# Altium project NB3000AL.PRJPCB (part 3 of 3)

## Sheet Mounts.SchDoc: NB3000AL Holes and Graphics
size A4; Organization: Altium Limited.; DocumentNumber: 19; Revision: 6; SheetNumber: 20; SheetTotal: 78
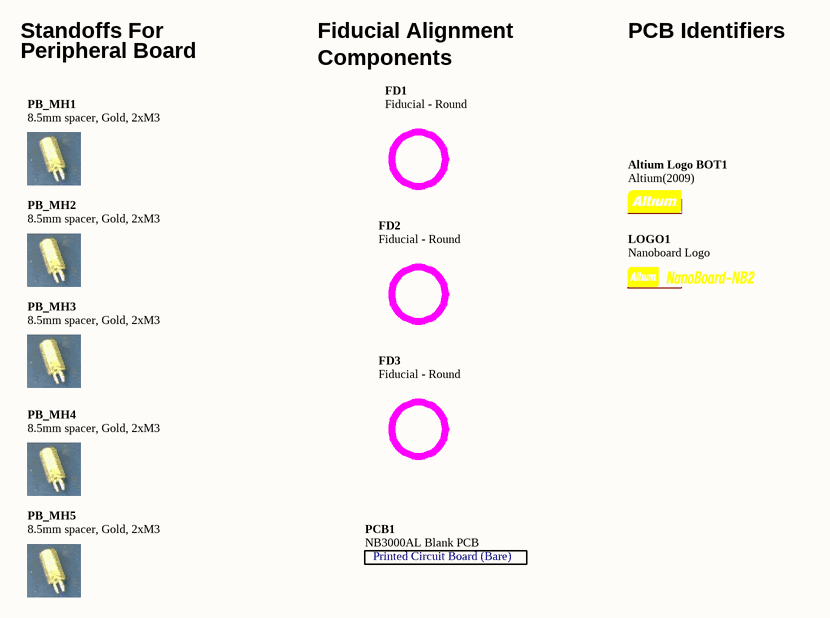
[diagram p24: Mounts.SchDoc]

### Parts
Altium_Logo_BOT1  Altium(2009)  [Logo-Altium-New]  (no BOM)
FD1  Fiducial - Round  [FIDUCIAL ROUND]  (no BOM)
FD2  Fiducial - Round  [FIDUCIAL ROUND]  (no BOM)
FD3  Fiducial - Round  [FIDUCIAL ROUND]  (no BOM)
LOGO1  Nanoboard Logo  [NANOBOARD LOGO]  (no BOM)
PB_MH1  8.5mm spacer, Gold, 2xM3  [STANDOFF_SOLDER_3MM]
PB_MH2  8.5mm spacer, Gold, 2xM3  [STANDOFF_SOLDER_3MM]
PB_MH3  8.5mm spacer, Gold, 2xM3  [STANDOFF_SOLDER_3MM]
PB_MH4  8.5mm spacer, Gold, 2xM3  [STANDOFF_SOLDER_3MM]
PB_MH5  8.5mm spacer, Gold, 2xM3  [STANDOFF_SOLDER_3MM]
PCB1  NB3000AL Blank PCB

### Nets
SHIELD: PB_MH1.STAND PB_MH2.STAND PB_MH3.STAND PB_MH4.STAND PB_MH5.STAND

### Notes on the sheet
- Peripheral Board
- Standoffs For
- Fiducial Alignment
- Components
- PCB Identifiers
- Sheet Title
- Project Title
- Size:
- Date:
- A4
- Assy:
- Time:
- Revision:
- Sheet
- of
- File:
- (in symbol D-810-0053) Printed Circuit Board (Bare)

### Library data of the parts
Altium_Logo_BOT1 = D-000-0003: Altium Logo for PCB; Category: Graphic-PCB; Status: Production
FD1-FD3 = D-004-0001: Fiducial - Round 1.5mm Top-Bottom; Status: Unreleased; Category: Fiducial
LOGO1 = D-000-0000: Status: Production; Category: Graphic-PCB
PB_MH1-PB_MH5 = D-306-0001: Spacer, 8.5mm GOLD, Splitted bottom, Female M3-thread; Category: Standoff; Status: Production
PCB1 = D-810-0053: NB3000AL Blank PCB - NanoBoard  3000 Series with Altera Cyclone3; ProjectPath: NB3000AL.PrjPCB; Status: Unreleased; Category: Blank PCB

## Sheet PBCON.schdoc: Peripheral Board Connector
size A4; Organization: Altium Limited.; Address1: Level 3, 12a Rodborough Rd; Address2: Frenchs Forest 2086; Address3: NSW; Address4: AUSTRALIA; SheetNumber: 1; SheetTotal: 100
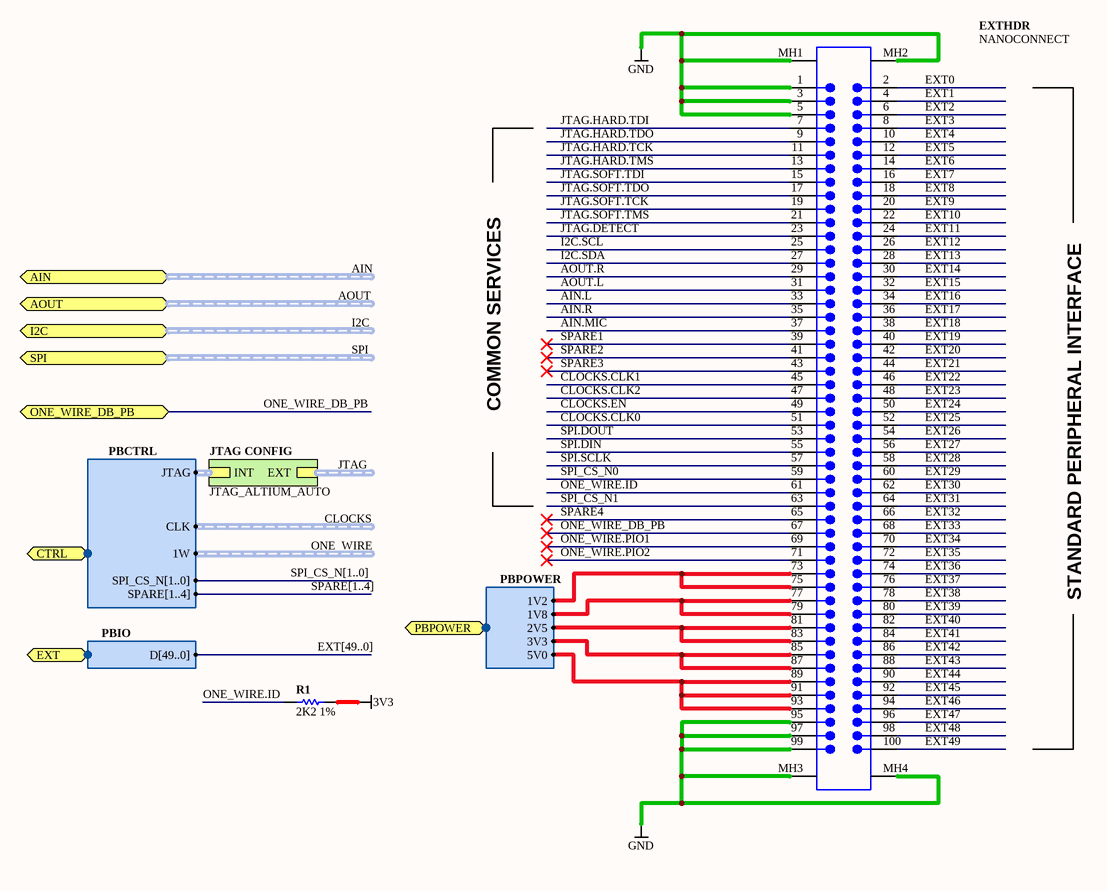
[diagram p25: PBCON.schdoc]

### Parts
(Parts that share a designator on the sheet are numbered #1, #2 ... from top to bottom, then left to right.)
EXTHDR  NANOCONNECT  [53751]
R1#5  2K2 1%  [RESC1005-STAR]

### Sub-sheets
JTAG CONFIG = JTAG_ALTIUM_AUTO (file not in this document): EXT (harness JTAG_CONFIG), INT (harness JTAG_CONFIG)

### Ports
AIN (harness AUDIO_IN), AOUT (harness AUDIO_OUT), CTRL (harness PBCTRL), EXT (harness PBIO), I2C (harness I2C), ONE_WIRE_DB_PB (bidir), PBPOWER (harness PBPOWER), SPI (harness EXTSPI)

### Harnesses
PBIO: D[49..0]
PBCTRL: JTAG, CLK, 1W, SPI_CS_N[1..0], SPARE[1..4]
PBPOWER: 1V2, 1V8, 2V5, 3V3, 5V0

### Nets
3V3: R1#5.2
GND: EXTHDR.1 EXTHDR.3 EXTHDR.5 EXTHDR.95 EXTHDR.97 EXTHDR.99 EXTHDR.MH1 EXTHDR.MH2 EXTHDR.MH3 EXTHDR.MH4
AIN.L: EXTHDR.33
AIN.MIC: EXTHDR.37
AIN.R: EXTHDR.35
AOUT.L: EXTHDR.31
AOUT.R: EXTHDR.29
CLOCKS.CLK0: EXTHDR.51
CLOCKS.CLK1: EXTHDR.45
CLOCKS.CLK2: EXTHDR.47
CLOCKS.EN: EXTHDR.49
EXT0: EXTHDR.2
EXT1: EXTHDR.4
EXT2: EXTHDR.6
EXT3: EXTHDR.8
EXT4: EXTHDR.10
EXT5: EXTHDR.12
EXT6: EXTHDR.14
EXT7: EXTHDR.16
EXT8: EXTHDR.18
EXT9: EXTHDR.20
EXT10: EXTHDR.22
EXT11: EXTHDR.24
EXT12: EXTHDR.26
EXT13: EXTHDR.28
EXT14: EXTHDR.30
EXT15: EXTHDR.32
EXT16: EXTHDR.34
EXT17: EXTHDR.36
EXT18: EXTHDR.38
EXT19: EXTHDR.40
EXT20: EXTHDR.42
EXT21: EXTHDR.44
EXT22: EXTHDR.46
EXT23: EXTHDR.48
EXT24: EXTHDR.50
EXT25: EXTHDR.52
EXT26: EXTHDR.54
EXT27: EXTHDR.56
EXT28: EXTHDR.58
EXT29: EXTHDR.60
EXT30: EXTHDR.62
EXT31: EXTHDR.64
EXT32: EXTHDR.66
EXT33: EXTHDR.68
EXT34: EXTHDR.70
EXT35: EXTHDR.72
EXT36: EXTHDR.74
EXT37: EXTHDR.76
EXT38: EXTHDR.78
EXT39: EXTHDR.80
EXT40: EXTHDR.82
EXT41: EXTHDR.84
EXT42: EXTHDR.86
EXT43: EXTHDR.88
EXT44: EXTHDR.90
EXT45: EXTHDR.92
EXT46: EXTHDR.94
EXT47: EXTHDR.96
EXT48: EXTHDR.98
EXT49: EXTHDR.100
I2C.SCL: EXTHDR.25
I2C.SDA: EXTHDR.27
JTAG.DETECT: EXTHDR.23
JTAG.HARD.TCK: EXTHDR.11
JTAG.HARD.TDI: EXTHDR.7
JTAG.HARD.TDO: EXTHDR.9
JTAG.HARD.TMS: EXTHDR.13
JTAG.SOFT.TCK: EXTHDR.19
JTAG.SOFT.TDI: EXTHDR.15
JTAG.SOFT.TDO: EXTHDR.17
JTAG.SOFT.TMS: EXTHDR.21
ONE_WIRE.ID: EXTHDR.61 R1#5.1
ONE_WIRE.PIO1: EXTHDR.69
ONE_WIRE.PIO2: EXTHDR.71
ONE_WIRE_DB_PB: EXTHDR.67 ; port ONE_WIRE_DB_PB
SPARE1: EXTHDR.39
SPARE2: EXTHDR.41
SPARE3: EXTHDR.43
SPARE4: EXTHDR.65
SPI.DIN: EXTHDR.55
SPI.DOUT: EXTHDR.53
SPI.SCLK: EXTHDR.57
SPI_CS_N0: EXTHDR.59
SPI_CS_N1: EXTHDR.63
NetEXTHDR_73: EXTHDR.73 EXTHDR.75 ; port PBPOWER.1V2
NetEXTHDR_77: EXTHDR.77 EXTHDR.79 ; port PBPOWER.1V8
NetEXTHDR_81: EXTHDR.81 EXTHDR.83 ; port PBPOWER.2V5
NetEXTHDR_85: EXTHDR.85 EXTHDR.87 ; port PBPOWER.3V3
NetEXTHDR_89: EXTHDR.89 EXTHDR.91 EXTHDR.93 ; port PBPOWER.5V0

### Buses and harness runs
bus EXT[49..0]
bus SPARE[1..4]
bus SPI_CS_N[1..0]
harness AIN = port AIN
harness AOUT = port AOUT
harness I2C = port I2C
harness JTAG = sheet JTAG CONFIG/EXT
harness SPI = port SPI

### Notes on the sheet
- COMMON SERVICES
- STANDARD PERIPHERAL INTERFACE
- Sheet Title
- Project Title
- Size:
- Date:
- A4
- Assy:
- Time:
- Revision:
- Sheet
- of
- File:

### Library data of the parts
EXTHDR = D-300-0026: Connector, Molex Docking Station 100 Pin Female 53751; Connector type: MOLEX - 53751-1009; Category: Connector; Status: Production
R1#5 = D-100-0107: Resistor, 2K2 1% 0402 (1005); Power Rating: 63 mW; Resistance: 2.2 K; Category: Resistor; Mounting Technology: Surface Mount; Status: Production; Tolerance: 1 %

## Sheet CON_SPDIF_INOUT_A.SchDoc: S/PDIF RCA IN/OUT
size A4; Organization: Altium Limited.; Address1: Level 3, 12a Rodborough Rd; Address2: Frenchs Forest 2086; Address3: NSW; Address4: AUSTRALIA; DocumentNumber: 51; SheetNumber: 52; SheetTotal: 78
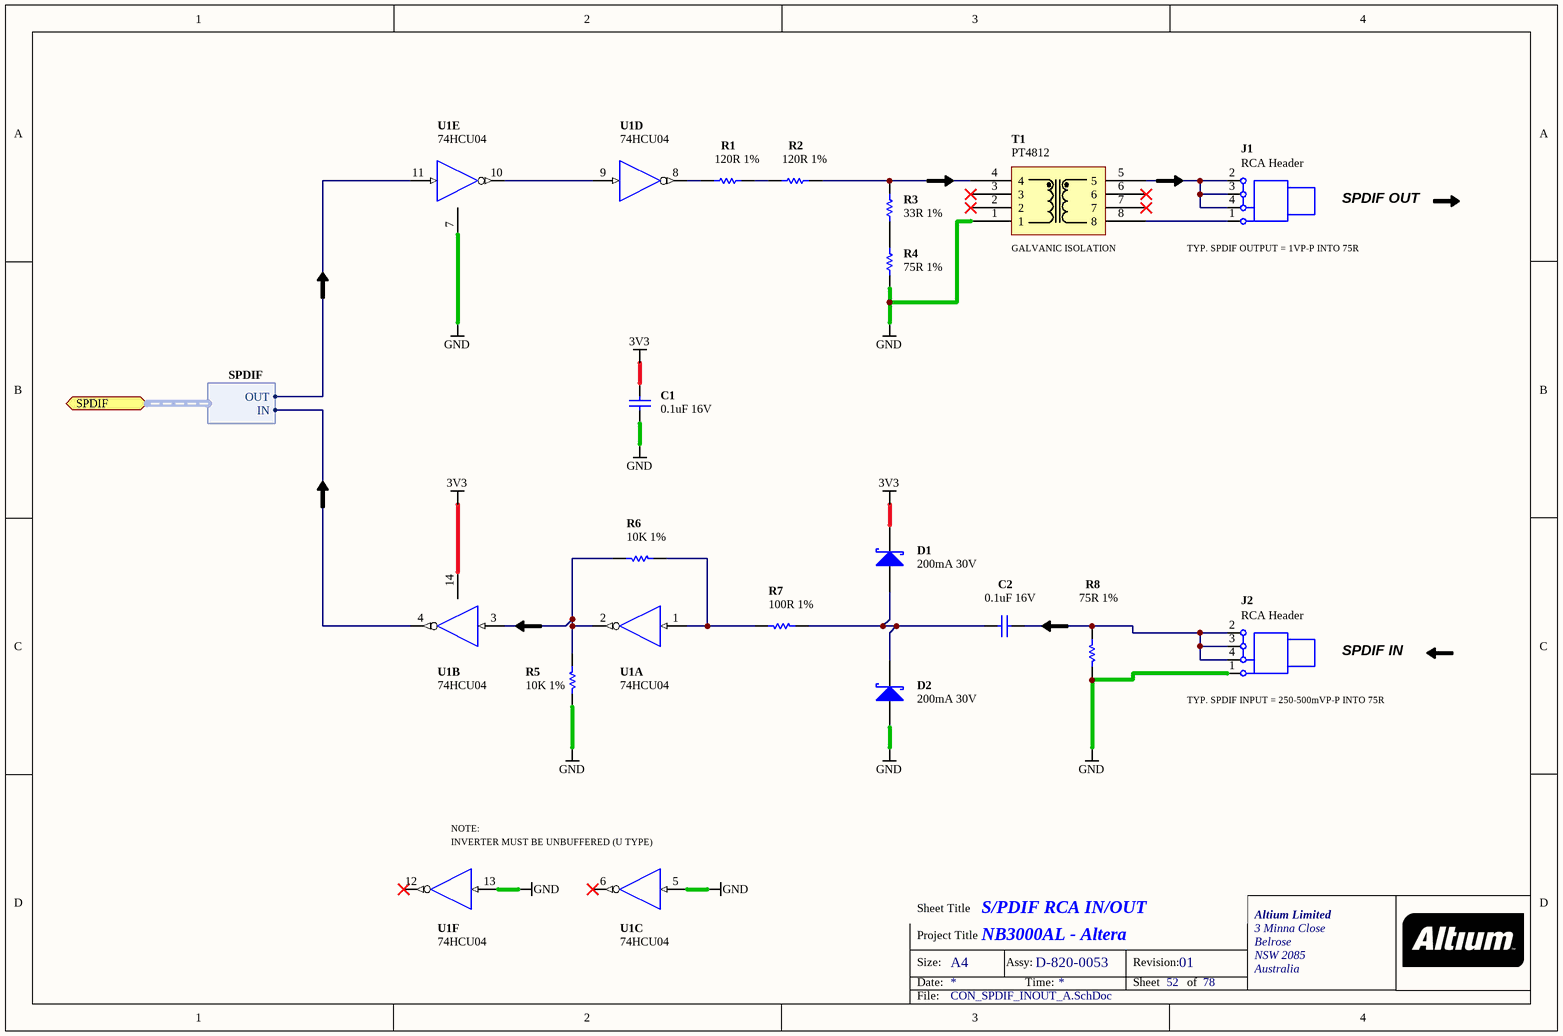
[diagram p26: CON_SPDIF_INOUT_A.SchDoc]

### Parts
(Parts that share a designator on the sheet are numbered #1, #2 ... from top to bottom, then left to right.)
C1#3  0.1uF 16V  [CAPC1005-STAR]
C2#4  0.1uF 16V  [CAPC1005-STAR]
D1  200mA 30V  [SOT95P230-3C]
D2  200mA 30V  [SOT95P230-3C]
J1#5  RCA Header  [TRC-005]
J2#2  RCA Header  [TRC-005]
R1#6  120R 1%  [RESC1005-STAR]
R2#5  120R 1%  [RESC1005-STAR]
R3#5  33R 1%  [RESC1005-STAR]
R4#3  75R 1%  [RESC1005-STAR]
R5#1  10K 1%  [RESC1005-STAR]
R6#2  10K 1%  [RESC1005-STAR]
R7#2  100R 1%  [RESC1005-STAR]
R8#3  75R 1%  [RESC1005-STAR]
T1  PT4812  [PT4812]
U1#3  74HCU04  [TSSOP14]  (parts A,B,C,D,E,F of 6)

### Ports
SPDIF (harness SPDIF)

### Harnesses
SPDIF: IN, OUT

### Nets
3V3: C1#3.2 D1.3(k) U1#3.14(VCC)
GND: C1#3.1 D2.1(A) J2#2.1(Black) R4#3.2 R5#1.1 R8#3.2 T1.1 U1#3.5(A) U1#3.7(GND) U1#3.13(A)
NetC2#4_1: C2#4.1 J2#2.2(Yellow) J2#2.3(White) J2#2.4(Red) R8#3.1
NetC2#4_2: C2#4.2 D1.1(A) D2.3(k) R7#2.2
NetJ1#5_1: J1#5.1(Black) T1.8
NetJ1#5_2: J1#5.2(Yellow) J1#5.3(White) J1#5.4(Red) T1.5
NetR1#6_1: R1#6.1 U1#3.8(Y)
NetR1#6_2: R1#6.2 R2#5.1
NetR2#5_2: R2#5.2 R3#5.2 T1.4
NetR3#5_1: R3#5.1 R4#3.1
NetR5#1_2: R5#1.2 R6#2.2 U1#3.2(Y) U1#3.3(A)
NetR6#2_1: R6#2.1 R7#2.1 U1#3.1(A)
NetU1#3_4: U1#3.4(Y) ; port SPDIF.IN
NetU1#3_9: U1#3.9(A) U1#3.10(Y)
NetU1#3_11: U1#3.11(A) ; port SPDIF.OUT

Not connected (* = marked no-connect by the designer): D1 2; D2 2; T1 2* 3* 6* 7*; U1#3 6(Y)* 12(Y)*

### Notes on the sheet
- (near T1) GALVANIC ISOLATION
- (near J1#5) TYP. SPDIF OUTPUT = 1VP-P INTO 75R
- SPDIF OUT
- SPDIF IN
- (near J2#2) TYP. SPDIF INPUT = 250-500mVP-P INTO 75R
- (near U1#3) NOTE:
- (near U1#3) INVERTER MUST BE UNBUFFERED (U TYPE)
- Sheet Title
- Project Title
- Size:
- Date:
- A4
- Assy:
- Time:
- Revision:
- Sheet
- of
- File:

### Library data of the parts
C1#3 C2#4 = D-101-0080: as C344#1 on sheet FPGA_NonIO; Capacitance: 0.1 uF; Category: Capacitor; Dielectric: X7R; Mounting Technology: Surface Mount; Rated Voltage: 16 V; Status: Production; Technology: Ceramic; Tolerance: 10 %
D1 D2 = D-151-0002: Schottky Diode, BAT54 30V 200mA 30V SOT-23; Rated Voltage: 30 mV; Max Forward Current: 200 mA; Mounting Technology: Surface Mount; Status: Production; Category: Diode-Schottky
J1#5 J2#2 = D-300-0132: Connector, TRC-005-4 , Black RCA Phono Jack, Right Angle, Thru-Hole, Snap-In; Max Current: mA; Connector type: Header; Mounting Technology: Through-Hole; Status: Unreleased; Category: Connector
R1#6 R2#5 = D-100-0126: Resistor, 120R 1% 0402 (1005); Power Rating: 63 mW; Mounting Technology: Surface Mount; Resistance: 120 R; Status: Production; Tolerance: 1 %; Category: Resistor
R3#5 = D-100-0102: Resistor, 33R 1% 0402 (1005); Power Rating: 63 mW; Mounting Technology: Surface Mount; Resistance: 33 R; Status: Production; Tolerance: 1 %; Category: Resistor
R4#3 R8#3 = D-100-0001: Resistor, 75R 1% 0402; Power Rating: 1/16 W; Mounting Technology: Surface Mount; Resistance: 75 R; Status: Production; Tolerance: 1 %; Category: Resistor
R5#1 R6#2 = D-100-0130: as R3#2 on sheet Host_FPGA; Mounting Technology: Surface Mount; Resistance: 10 K; Status: Production; Tolerance: 1 %; Category: Resistor
R7#2 = D-100-0131: Resistor, 100R 1% 0402 (1005); Power Rating: 63 mW; Mounting Technology: Surface Mount; Resistance: 100 R; Status: Production; Tolerance: 1 %; Category: Resistor
T1 = D-107-0004: Transformer, 1:1, SMD, 0 to 70 deg C,  1 to 7 Mbps, 500Vrms min; Status: Unreleased; Category: Transformer
U1#3 = D-205-0010: 74HCU04, HEX Inverter, Unbuffered; Mounting Technology: Surface Mount; Status: Production; Category: IC-Logic

## Sheet USB_ISP1760.SchDoc: USB-host Controller IC
size A3; Organization: Altium Limited.; DocumentNumber: 57; SheetNumber: 58; SheetTotal: 78
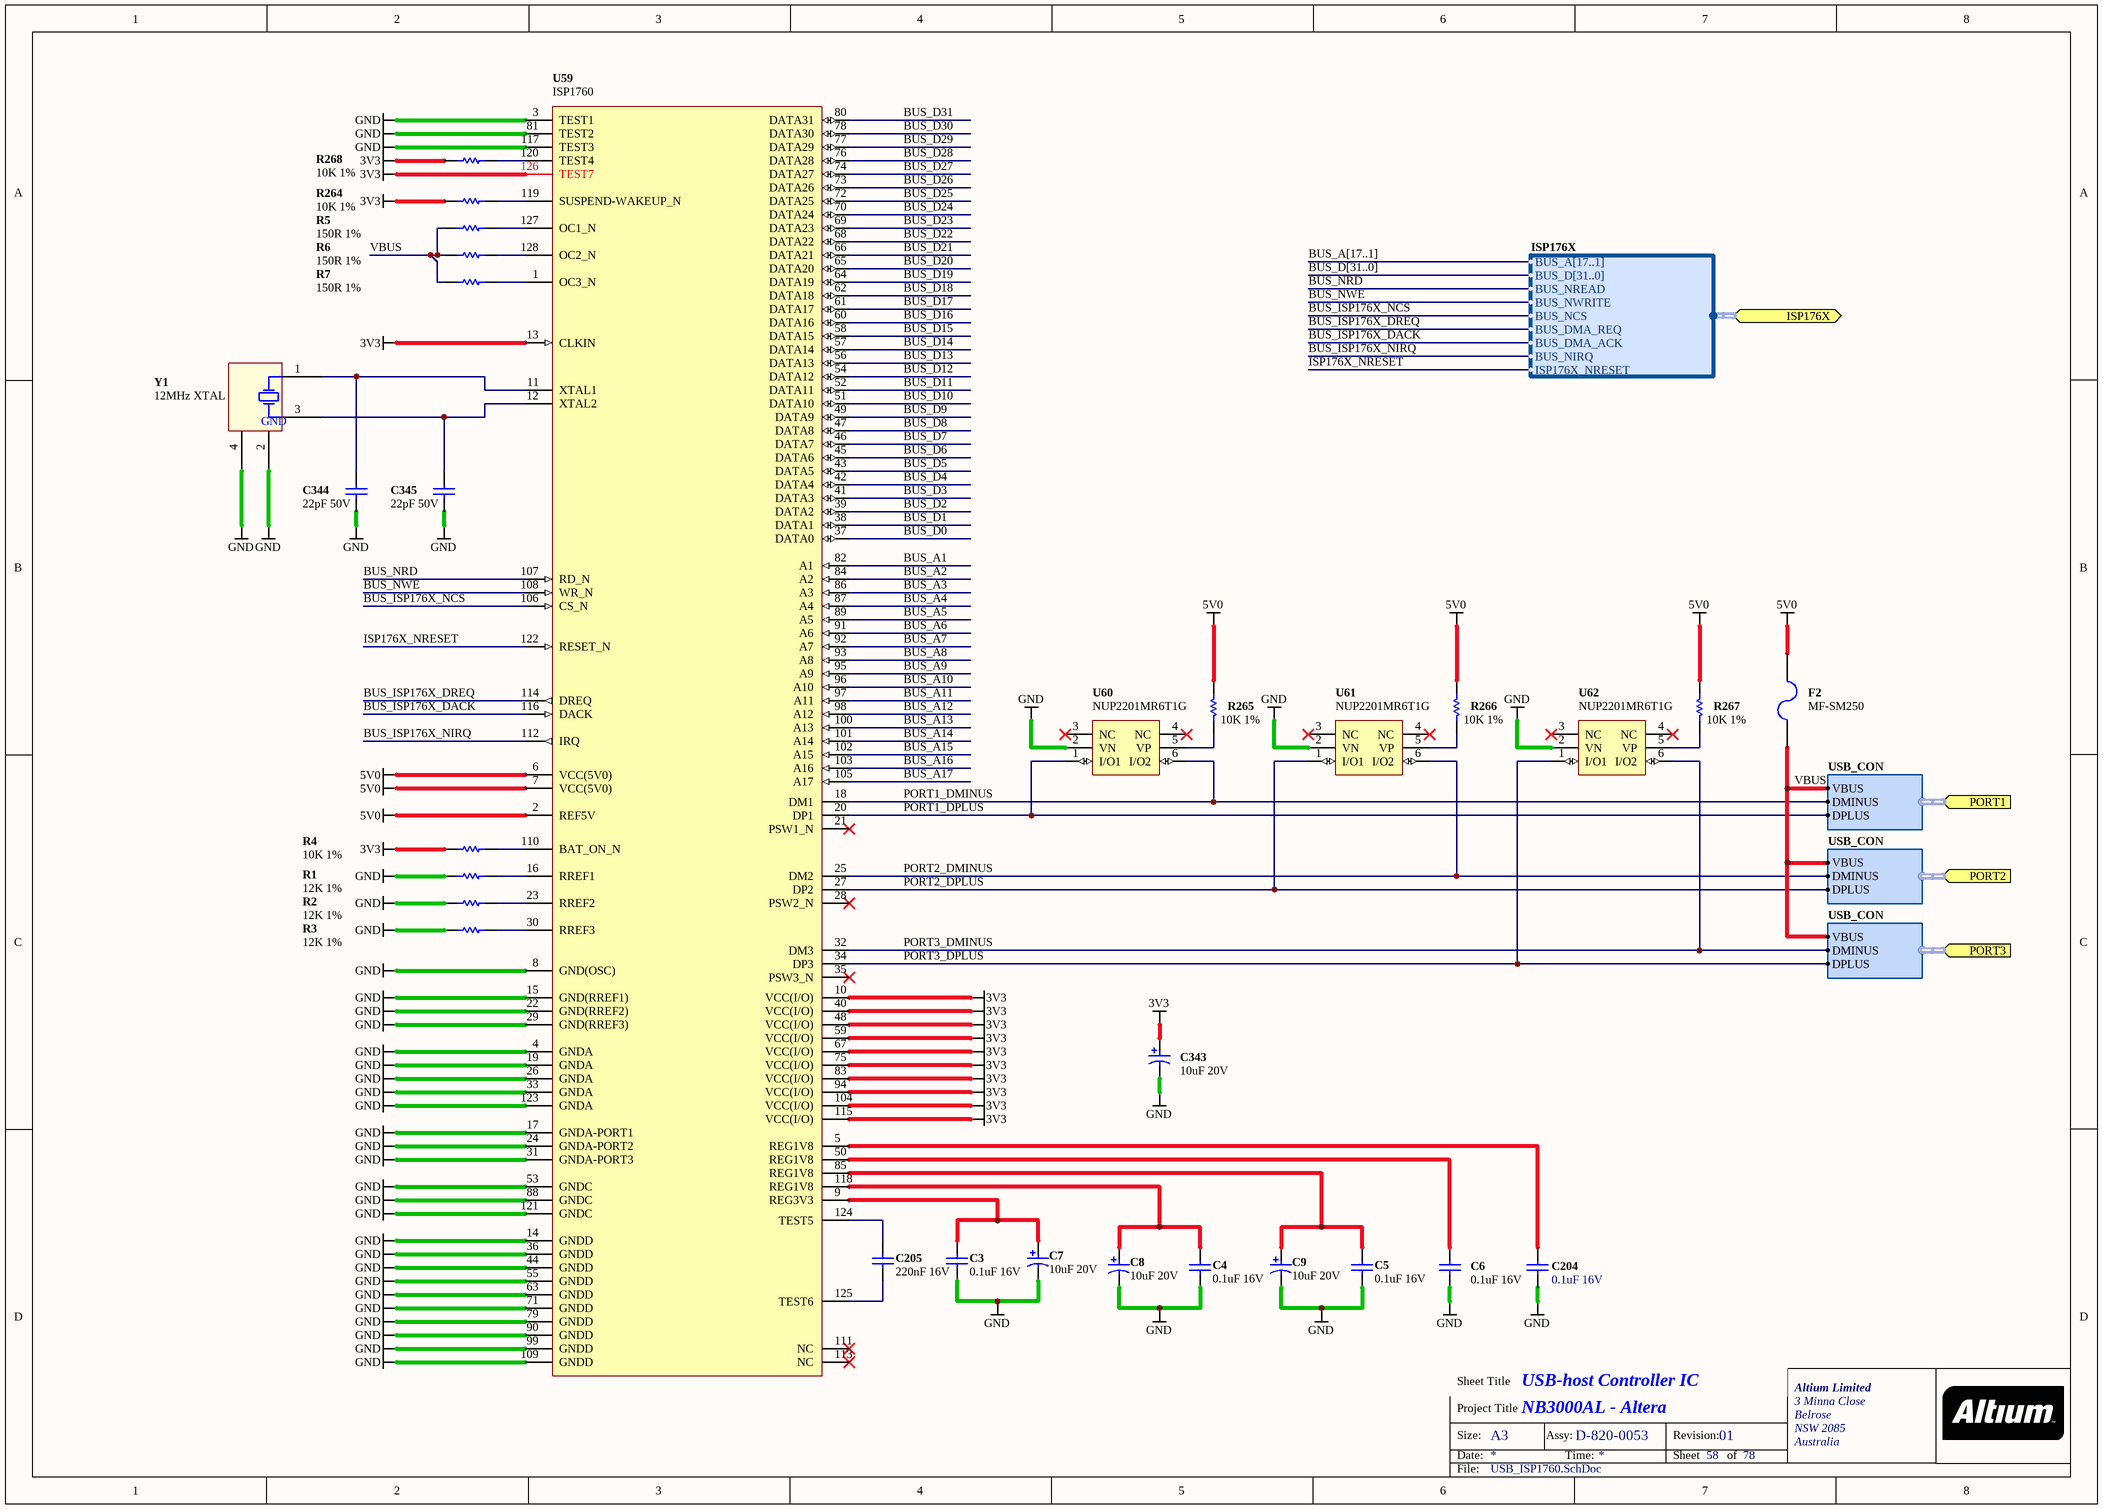
[diagram p27: USB_ISP1760.SchDoc]

### Parts
(Parts that share a designator on the sheet are numbered #1, #2 ... from top to bottom, then left to right.)
C3#4  0.1uF 16V  [CAPC1005-STAR]
C4#3  0.1uF 16V  [CAPC1005-STAR]
C5#2  0.1uF 16V  [CAPC1005-STAR]
C6#2  0.1uF 16V  [CAPC1005-STAR]
C7#2  10uF 20V  [CAPC3528-STAR]
C8#2  10uF 20V  [CAPC3528-STAR]
C9#2  10uF 20V  [CAPC3528-STAR]
C204  0.1uF 16V  [CAPC1005-STAR]
C205  220nF 16V  [CAPC1005-STAR]
C343#2  10uF 20V  [CAPC3528-STAR]
C344#2  22pF 50V  [CAPC1005-STAR]
C345#2  22pF 50V  [CAPC1005-STAR]
F2  MF-SM250  [MF_SM250]
R1#7  12K 1%  [RESC1005-STAR]
R2#6  12K 1%  [RESC1005-STAR]
R3#6  12K 1%  [RESC1005-STAR]
R4#4  10K 1%  [RESC1005-STAR]
R5#2  150R 1%  [RESC1005-STAR]
R6#3  150R 1%  [RESC1005-STAR]
R7#3  150R 1%  [RESC1005-STAR]
R264  10K 1%  [RESC1005-STAR]
R265  10K 1%  [RESC1005-STAR]
R266  10K 1%  [RESC1005-STAR]
R267  10K 1%  [RESC1005-STAR]
R268  10K 1%  [RESC1005-STAR]
U59  ISP1760  [SOT425-1]
U60  NUP2201MR6T1G  [TSOP95P275-6]
U61  NUP2201MR6T1G  [TSOP95P275-6]
U62  NUP2201MR6T1G  [TSOP95P275-6]
Y1#2  12MHz XTAL  [XTAL-200X126-4]

### Ports
ISP176X (harness ISP176X), PORT1 (harness USB_CON), PORT2 (harness USB_CON), PORT3 (harness USB_CON)

### Harnesses
USB_CON: VBUS, DMINUS, DPLUS
ISP176X: BUS_A[17..1], BUS_D[31..0], BUS_NREAD, BUS_NCS, BUS_DMA_REQ, BUS_DMA_ACK, BUS_NIRQ, BUS_NWRITE, ISP176X_NRESET

### Nets
3V3: C343#2.1 R4#4.2 R264.2 R268.2 U59.10(VCC(I/O)) U59.13(CLKIN) U59.40(VCC(I/O)) U59.48(VCC(I/O)) U59.59(VCC(I/O)) U59.67(VCC(I/O)) U59.75(VCC(I/O)) U59.83(VCC(I/O)) U59.94(VCC(I/O)) U59.104(VCC(I/O)) U59.115(VCC(I/O)) U59.126(TEST7)
5V0: F2.2 R265.2 R266.2 R267.2 U59.2(REF5V) U59.6(VCC(5V0)) U59.7(VCC(5V0))
GND: C3#4.2 C4#3.2 C5#2.2 C6#2.2 C7#2.2 C8#2.2 C9#2.2 C204.2 C343#2.2 C344#2.1 C345#2.1 R1#7.2 R2#6.2 R3#6.2 U59.3(TEST1) U59.4(GNDA) U59.8(GND(OSC)) U59.14(GNDD) U59.15(GND(RREF1)) U59.17(GNDA-PORT1) U59.19(GNDA) U59.22(GND(RREF2)) U59.24(GNDA-PORT2) U59.26(GNDA) U59.29(GND(RREF3)) U59.31(GNDA-PORT3) U59.33(GNDA) U59.36(GNDD) U59.44(GNDD) U59.53(GNDC) U59.55(GNDD) U59.63(GNDD) U59.71(GNDD) U59.79(GNDD) U59.81(TEST2) U59.88(GNDC) U59.90(GNDD) U59.99(GNDD) U59.109(GNDD) U59.117(TEST3) U59.121(GNDC) U59.123(GNDA) U60.2(VN) U61.2(VN) U62.2(VN) Y1#2.2(GND) Y1#2.4(GND)
BUS_A1: U59.82(A1)
BUS_A2: U59.84(A2)
BUS_A3: U59.86(A3)
BUS_A4: U59.87(A4)
BUS_A5: U59.89(A5)
BUS_A6: U59.91(A6)
BUS_A7: U59.92(A7)
BUS_A8: U59.93(A8)
BUS_A9: U59.95(A9)
BUS_A10: U59.96(A10)
BUS_A11: U59.97(A11)
BUS_A12: U59.98(A12)
BUS_A13: U59.100(A13)
BUS_A14: U59.101(A14)
BUS_A15: U59.102(A15)
BUS_A16: U59.103(A16)
BUS_A17: U59.105(A17)
BUS_D0: U59.37(DATA0)
BUS_D1: U59.38(DATA1)
BUS_D2: U59.39(DATA2)
BUS_D3: U59.41(DATA3)
BUS_D4: U59.42(DATA4)
BUS_D5: U59.43(DATA5)
BUS_D6: U59.45(DATA6)
BUS_D7: U59.46(DATA7)
BUS_D8: U59.47(DATA8)
BUS_D9: U59.49(DATA9)
BUS_D10: U59.51(DATA10)
BUS_D11: U59.52(DATA11)
BUS_D12: U59.54(DATA12)
BUS_D13: U59.56(DATA13)
BUS_D14: U59.57(DATA14)
BUS_D15: U59.58(DATA15)
BUS_D16: U59.60(DATA16)
BUS_D17: U59.61(DATA17)
BUS_D18: U59.62(DATA18)
BUS_D19: U59.64(DATA19)
BUS_D20: U59.65(DATA20)
BUS_D21: U59.66(DATA21)
BUS_D22: U59.68(DATA22)
BUS_D23: U59.69(DATA23)
BUS_D24: U59.70(DATA24)
BUS_D25: U59.72(DATA25)
BUS_D26: U59.73(DATA26)
BUS_D27: U59.74(DATA27)
BUS_D28: U59.76(DATA28)
BUS_D29: U59.77(DATA29)
BUS_D30: U59.78(DATA30)
BUS_D31: U59.80(DATA31)
BUS_ISP176X_DACK: U59.116(DACK) ; port ISP176X.BUS_DMA_ACK
BUS_ISP176X_DREQ: U59.114(DREQ) ; port ISP176X.BUS_DMA_REQ
BUS_ISP176X_NCS: U59.106(CS_N) ; port ISP176X.BUS_NCS
BUS_ISP176X_NIRQ: U59.112(IRQ) ; port ISP176X.BUS_NIRQ
BUS_NRD: U59.107(RD_N) ; port ISP176X.BUS_NREAD
BUS_NWE: U59.108(WR_N) ; port ISP176X.BUS_NWRITE
ISP176X_NRESET: U59.122(RESET_N) ; port ISP176X.ISP176X_NRESET
PORT1_DMINUS: U59.18(DM1) U60.6(I/O2) ; port PORT1.DMINUS
PORT1_DPLUS: U59.20(DP1) U60.1(I/O1) ; port PORT1.DPLUS
PORT2_DMINUS: U59.25(DM2) U61.6(I/O2) ; port PORT2.DMINUS
PORT2_DPLUS: U59.27(DP2) U61.1(I/O1) ; port PORT2.DPLUS
PORT3_DMINUS: U59.32(DM3) U62.6(I/O2) ; port PORT3.DMINUS
PORT3_DPLUS: U59.34(DP3) U62.1(I/O1) ; port PORT3.DPLUS
VBUS: F2.1 R5#2.2 R6#3.2 R7#3.2 ; port PORT3.VBUS, port PORT2.VBUS, port PORT1.VBUS
NetC3#4_1: C3#4.1 C7#2.1 U59.9(REG3V3)
NetC4#3_1: C4#3.1 C8#2.1 U59.118(REG1V8)
NetC5#2_1: C5#2.1 C9#2.1 U59.85(REG1V8)
NetC6#2_1: C6#2.1 U59.50(REG1V8)
NetC204_1: C204.1 U59.5(REG1V8)
NetC205_1: C205.1 U59.124(TEST5)
NetC205_2: C205.2 U59.125(TEST6)
NetC344#2_2: C344#2.2 U59.11(XTAL1) Y1#2.1(X1)
NetC345#2_2: C345#2.2 U59.12(XTAL2) Y1#2.3(X2)
NetR1#7_1: R1#7.1 U59.16(RREF1)
NetR2#6_1: R2#6.1 U59.23(RREF2)
NetR3#6_1: R3#6.1 U59.30(RREF3)
NetR4#4_1: R4#4.1 U59.110(BAT_ON_N)
NetR5#2_1: R5#2.1 U59.127(OC1_N)
NetR6#3_1: R6#3.1 U59.128(OC2_N)
NetR7#3_1: R7#3.1 U59.1(OC3_N)
NetR264_1: R264.1 U59.119(SUSPEND-WAKEUP_N)
NetR265_1: R265.1 U60.5(VP)
NetR266_1: R266.1 U61.5(VP)
NetR267_1: R267.1 U62.5(VP)
NetR268_1: R268.1 U59.120(TEST4)

Not connected (* = marked no-connect by the designer): U59 21(PSW1_N)* 28(PSW2_N)* 35(PSW3_N)* 111(NC)* 113(NC)*; U60 3(NC)* 4(NC)*; U61 3(NC)* 4(NC)*; U62 3(NC)* 4(NC)*

### Buses and harness runs
bus BUS_A[17..1]
bus BUS_D[31..0]

### Notes on the sheet
- Sheet Title
- Project Title
- Size:
- Date:
- A3
- Assy:
- Time:
- Revision:
- Sheet
- of
- File:

### Library data of the parts
C3#4 C4#3 C5#2 C6#2 C204 = D-101-0080: Capacitor, Ceramic, 0.1uF 10% 16V 0402 (1005) X7R; Polarity: Non-Polarized; Category: Capacitor; Dielectric: X7R; Mounting Technology: Surface Mount; Status: Production; Technology: Ceramic
  C3#4 C4#3 C5#2 C6#2: Capacitance: 0.1 uF; Rated Voltage: 16 V; Tolerance: 10 %
  C204: Capacitance: 0.1uF; Rated Voltage: 16V; Tolerance: 10%
C7#2 C8#2 C9#2 C343#2 = D-101-0007: Capacitor, Tantalum, 10uF 10% 20V MCCT-B (3528); Polarity: Polarized; Capacitance: 10 uF; Category: Capacitor; Mounting Technology: Surface Mount; Rated Voltage: 20 V; Status: Production; Technology: Tantalum; Tolerance: 10 %
C205 = D-101-0116: Capacitor, Ceramic, 220nF 10% 16V 0402 (1005) X5R; Polarity: Non-Polarized; Capacitance: 220 nF; Category: Capacitor; Dielectric: X5R; Mounting Technology: Surface Mount; Rated Voltage: 16 V; Status: Production; Technology: Ceramic; Tolerance: 10 %
C344#2 C345#2 = D-101-0059: Capacitor, Ceramic, 22pF 5% 50V 0402 (1005) COG; Polarity: Non-Polarized; Capacitance: 22 pF; Category: Capacitor; Dielectric: COG; Mounting Technology: Surface Mount; Rated Voltage: 50 V; Status: Unreleased; Technology: Ceramic; Tolerance: 5 %
F2 = D-106-0000: Mutifuse, SMD 5A; Rated Voltage: 15V; Amperage: 5A; Category: Fuse
R1#7 R2#6 R3#6 = D-100-0002: Resistor, 12K 1% 0402; Power Rating: mW; Resistance: mR; Tolerance: %; Category: Resistor; Mounting Technology: Surface Mount; Status: Unreleased
R4#4 R264-R268 = D-100-0130: Resistor, 10K 1% 0402 (1005); Power Rating: 63 mW; Category: Resistor; Mounting Technology: Surface Mount; Resistance: 10 K; Status: Production; Tolerance: 1 %
R5#2 R6#3 R7#3 = D-100-0005: Resistor, 150R 1% 0402 (1005); Power Rating: 63mW; Category: Resistor; Mounting Technology: Surface Mount; Resistance: 150R; Status: Unreleased; Tolerance: 1%
U59 = D-221-0018: Hi-Speed Universal Serial Bus host controller; Comm Standard: None; Mounting Technology: Surface Mount; Status: Production; Category: IC-Communication
U60-U62 = D-204-0001: NUP2201MR6, Low Capacitance Diode Array, USB Protection; Max Input Voltage: mV; Max Output Current: mA; Category: IC-Power; Max Output Voltage: mV; Min Input Voltage: mV; Min Output Voltage: mV; Mounting Technology: Surface Mount; Status: Production; Supply Voltage: mV
Y1#2 = D-103-0000: Crystal, SMD, 12.000000MHz Stab=30ppm 20.0pF; Frequency Stability: 30ppm; Load Capacitance: 20pF; Nominal Operational Voltage: mV; Frequency Tolerance: 30ppm; Mounting Technology: Surface Mount; Nominal Fequency: 12MHz; Status: Production; Category: Crystal

## Nets that join several sheets
1V2: PSU (TP7.1), USER_DECOUPLING_CAPS_3V3 (14 pins), FPGA_NonIO (54 pins), HOST_FPGA_NonIO (10 pins), HOST_DECOUPLING_CAPS_3V3 (14 pins)
2V5: PSU (TP5.1), FPGA_NonIO (L4.1 L5.1 L6.1 L7.1), HOST_FPGA_NonIO (L8.1 L9.1)
3V3: Audio_Codec (R98.2 R154#1.2 U2000.4), PSU (TP4.1), FPGA (11 pins), USER_DECOUPLING_CAPS_3V3 (32 pins), FPGA_NonIO (60 pins), Host_FPGA (6 pins), HOST_FPGA_NonIO (30 pins), HOST_DECOUPLING_CAPS_3V3 (32 pins), USB_CY7C68001-56LFC (19 pins), OSC_24MHZ (C3#3.1 U1#2.5), CON_FFC40_LCDTFT (NT34.2 NT35.2 NT36.2 NT37.2), PBCON (R1#5.2), CON_SPDIF_INOUT_A (C1#3.2 D1.3 U1#3.14), USB_ISP1760 (16 pins)
5V0: PSU (6 pins), U_LED_01 (C1A.2 LED1A.2 LED2A.2 U1A.14), U_LED_23 (C1B.2 LED1B.2 LED2B.2 U1B.14), U_LED_45 (C1C.2 LED1C.2 LED2C.2 U1C.14), U_LED_67 (C1D.2 LED1D.2 LED2D.2 U1D.14), PWJACK+SWITCH (SW1.1 SW1.2), USB_ISP1760 (7 pins)
+B: PSU (TP3.1), PWJACK+SWITCH (D10.2 J1#2.1 SW1.3)
AUGND: PSU (NT1#1.1), CON_AUDIO_AC99_NOMIC (J1#4.1 J3#2.1 J4.1 J5.1)
GND: VGA_OUT (U1#1.2), Audio_Codec (U2000.1), PSU (16 pins), FPGA (6 pins), USER_DECOUPLING_CAPS_3V3 (46 pins), FPGA_NonIO (135 pins), PULLDOWN (R284A.1 R285A.1 R286A.1), PULLDOWN (R284B.1 R285B.1 R286B.1), PULLDOWN (R284C.1 R285C.1 R286C.1), PULLDOWN (R284D.1 R285D.1 R286D.1), PULLDOWN (R284E.1 R285E.1 R286E.1), PULLDOWN (R284F.1 R285F.1 R286F.1), PULLDOWN (R284G.1 R285G.1 R286G.1), PULLDOWN (R284H.1 R285H.1 R286H.1), U_LED_01 (C1A.1 U1A.7), U_LED_23 (C1B.1 U1B.7), U_LED_45 (C1C.1 U1C.7), U_LED_67 (C1D.1 U1D.7), PWJACK+SWITCH (D10.1 J1#2.2 J1#2.3), HOST_JTAG (J1#3.9 J1#3.10), Host_FPGA (R271.2 U69.2), HOST_FPGA_NonIO (43 pins), HOST_DECOUPLING_CAPS_3V3 (46 pins), PULLDOWN (R284I.1 R285I.1 R286I.1), PULLDOWN (R284J.1 R285J.1 R286J.1), USB_CY7C68001-56LFC (21 pins), OSC_24MHZ (6 pins), CON_FFC40_LCDTFT (5 pins), PBCON (10 pins), CON_SPDIF_INOUT_A (10 pins), USB_ISP1760 (47 pins)
SHIELD: PSU (C169.1 R248.1), PWJACK+SWITCH (SW1.S1 SW1.S2), Mounts (5 pins)
CONF_DONE: FPGA (R22.2), FPGA_NonIO (U8.P24)
DCLK: FPGA (R20.2), FPGA_NonIO (U8.P3)
FLASH_BOOT_CLK: Host_FPGA (U30.L6), HOST_FPGA_NonIO (U30.H1)
LED0_B: FPGA (U8.R3), PULLDOWN (R284A.2)
LED0_G: FPGA (U8.U1), PULLDOWN (R285A.2)
LED0_R: FPGA (U8.R2), PULLDOWN (R286A.2)
LED1_B: FPGA (U8.V4), PULLDOWN (R284B.2)
LED1_BLUE: Host_FPGA (U30.R7), PULLDOWN (R284I.2)
LED1_G: FPGA (U8.T3), PULLDOWN (R285B.2)
LED1_GREEN: Host_FPGA (U30.K8), PULLDOWN (R285I.2)
LED1_R: FPGA (U8.W9), PULLDOWN (R286B.2)
LED1_RED: Host_FPGA (U30.F5), PULLDOWN (R286I.2)
LED2_B: FPGA (U8.AD10), PULLDOWN (R284C.2)
LED2_BLUE: Host_FPGA (U30.B1), PULLDOWN (R284J.2)
LED2_G: FPGA (U8.AG11), PULLDOWN (R285C.2)
LED2_GREEN: Host_FPGA (U30.R9), PULLDOWN (R285J.2)
LED2_R: FPGA (U8.AC10), PULLDOWN (R286C.2)
LED2_RED: Host_FPGA (U30.C2), PULLDOWN (R286J.2)
LED3_B: FPGA (U8.AD11), PULLDOWN (R284D.2)
LED3_G: FPGA (U8.AC12), PULLDOWN (R285D.2)
LED3_R: FPGA (U8.Y13), PULLDOWN (R286D.2)
LED4_B: FPGA (U8.AB23), PULLDOWN (R284E.2)
LED4_G: FPGA (U8.AD26), PULLDOWN (R285E.2)
LED4_R: FPGA (U8.AB24), PULLDOWN (R286E.2)
LED5_B: FPGA (U8.AB20), PULLDOWN (R284F.2)
LED5_G: FPGA (U8.AA24), PULLDOWN (R285F.2)
LED5_R: FPGA (U8.AB25), PULLDOWN (R286F.2)
LED6_B: FPGA (U8.AA25), PULLDOWN (R284G.2)
LED6_G: FPGA (U8.AA23), PULLDOWN (R285G.2)
LED6_R: FPGA (U8.W26), PULLDOWN (R286G.2)
LED7_B: FPGA (U8.AD27), PULLDOWN (R284H.2)
LED7_G: FPGA (U8.AC28), PULLDOWN (R285H.2)
LED7_R: FPGA (U8.Y22), PULLDOWN (R286H.2)
nCONFIG: FPGA (R24.2), FPGA_NonIO (U8.P4)
nSTATUS: FPGA (R18.1), FPGA_NonIO (U8.M6)
TCK: FPGA (R9#1.2), FPGA_NonIO (U8.P5)
TDI: FPGA (R12.2), FPGA_NonIO (U8.P7)
TDO: FPGA (R10.2), FPGA_NonIO (U8.P6)
TMS: FPGA (R8#1.2), FPGA_NonIO (U8.P8)

## Assembly variants
Production: not fitted RN1 RN2 RN3 RN4 RN5 RN6 RN7 RN8 RN17 RN18 RN19 RN20 RN21 RN22 RN23 RN24 RN25 RN26 RN27 RN28 RN29 RN30 RN31 RN32